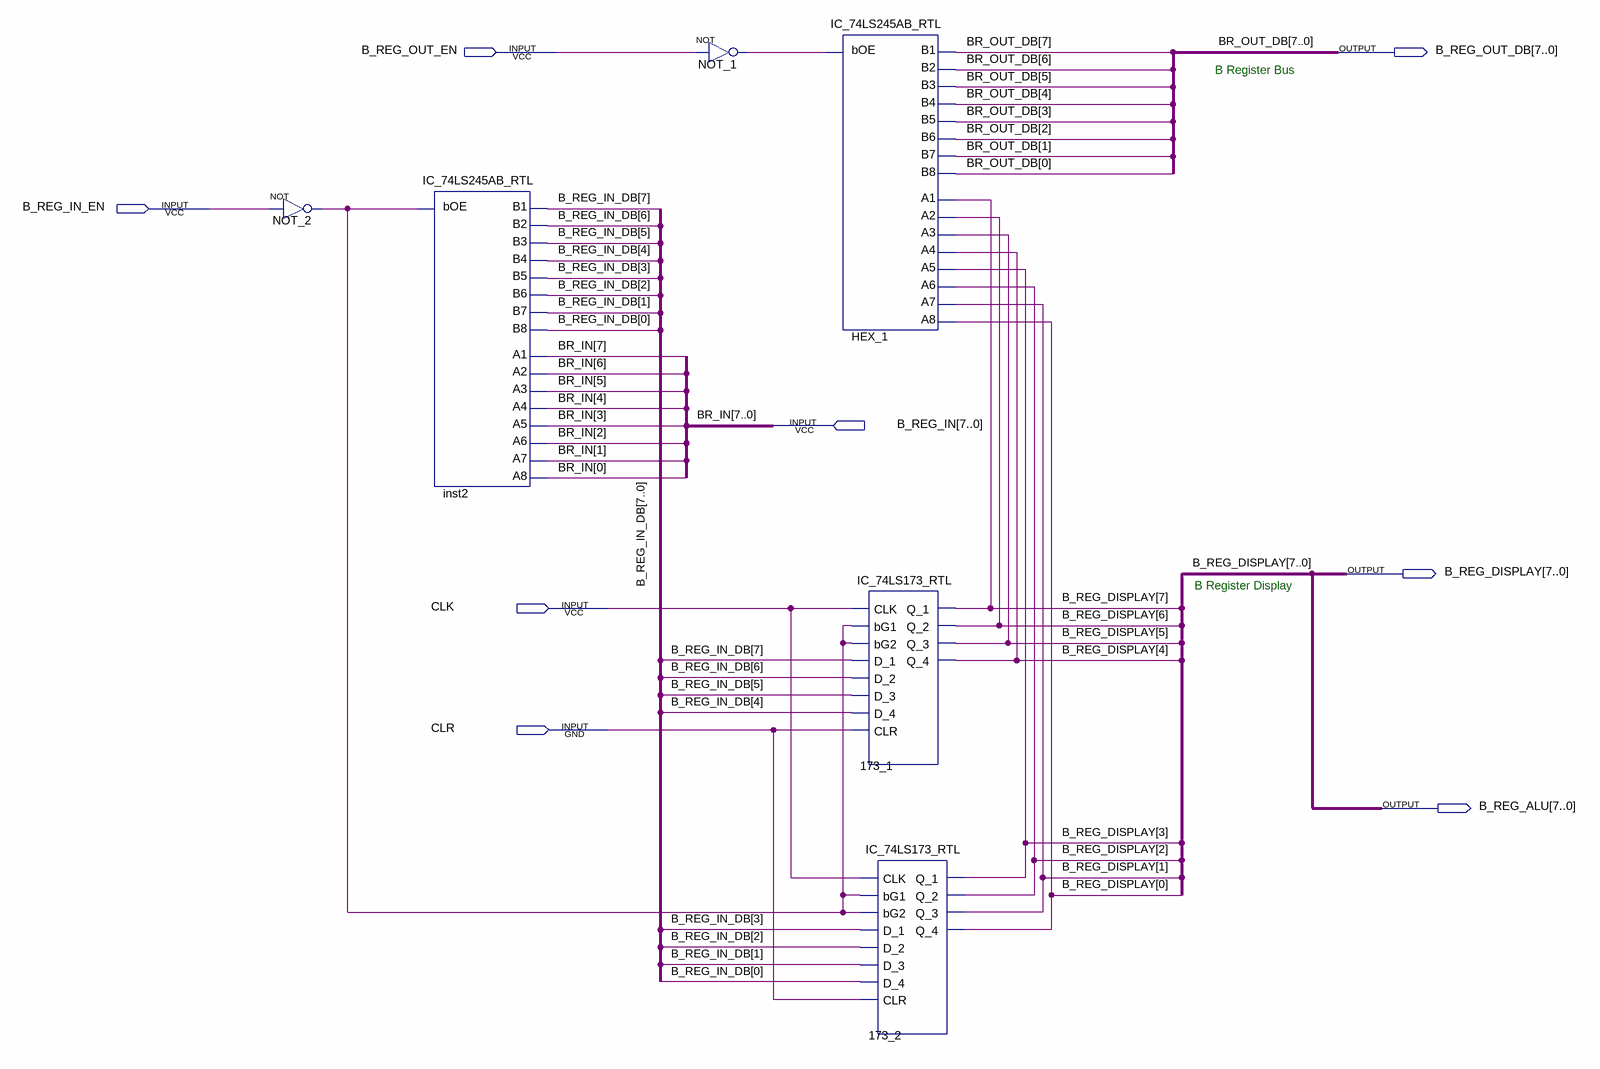
[diagram p0: schematic sheet]
// Quartus schematic B_Register.bdf as structural Verilog: 6 symbols, 8 pins
module B_Register (
  input  B_REG_OUT_EN,
  input  B_REG_IN_EN,
  input  [7:0] B_REG_IN,
  input  CLK,
  input  CLR,
  output [7:0] B_REG_OUT_DB,
  output [7:0] B_REG_DISPLAY,
  output [7:0] B_REG_ALU
);

  wire NOT_1_out, NOT_2_out;
  wire [7:0] B_REG_IN_DB;

  not NOT_2 (NOT_2_out, B_REG_IN_EN);
  IC_74LS245AB_RTL inst2 (
    .bOE(NOT_2_out), .A1(B_REG_IN[7]), .A2(B_REG_IN[6]), .A3(B_REG_IN[5]), .A4(B_REG_IN[4]),
    .A5(B_REG_IN[3]), .A6(B_REG_IN[2]), .A7(B_REG_IN[1]), .A8(B_REG_IN[0]), .B1(B_REG_IN_DB[7]),
    .B2(B_REG_IN_DB[6]), .B3(B_REG_IN_DB[5]), .B4(B_REG_IN_DB[4]), .B5(B_REG_IN_DB[3]), .B6(B_REG_IN_DB[2]),
    .B7(B_REG_IN_DB[1]), .B8(B_REG_IN_DB[0]));
  not NOT_1 (NOT_1_out, B_REG_OUT_EN);
  IC_74LS245AB_RTL HEX_1 (
    .bOE(NOT_1_out), .A1(B_REG_ALU[7]), .A2(B_REG_ALU[6]), .A3(B_REG_ALU[5]), .A4(B_REG_ALU[4]),
    .A5(B_REG_ALU[3]), .A6(B_REG_ALU[2]), .A7(B_REG_ALU[1]), .A8(B_REG_ALU[0]), .B1(B_REG_OUT_DB[7]),
    .B2(B_REG_OUT_DB[6]), .B3(B_REG_OUT_DB[5]), .B4(B_REG_OUT_DB[4]), .B5(B_REG_OUT_DB[3]),
    .B6(B_REG_OUT_DB[2]), .B7(B_REG_OUT_DB[1]), .B8(B_REG_OUT_DB[0]));
  IC_74LS173_RTL u_173_1 (
    .CLK(CLK), .bG1(NOT_2_out), .bG2(NOT_2_out), .D_1(B_REG_IN_DB[7]), .D_2(B_REG_IN_DB[6]),
    .D_3(B_REG_IN_DB[5]), .D_4(B_REG_IN_DB[4]), .CLR(CLR), .Q_1(B_REG_ALU[7]), .Q_2(B_REG_ALU[6]),
    .Q_3(B_REG_ALU[5]), .Q_4(B_REG_ALU[4]));
  IC_74LS173_RTL u_173_2 (
    .CLK(CLK), .bG1(NOT_2_out), .bG2(NOT_2_out), .D_1(B_REG_IN_DB[3]), .D_2(B_REG_IN_DB[2]),
    .D_3(B_REG_IN_DB[1]), .D_4(B_REG_IN_DB[0]), .CLR(CLR), .Q_1(B_REG_ALU[3]), .Q_2(B_REG_ALU[2]),
    .Q_3(B_REG_ALU[1]), .Q_4(B_REG_ALU[0]));

  assign B_REG_DISPLAY = B_REG_ALU;

  // Other names for the same wires on the sheet: BR_IN[7:0] = B_REG_IN; BR_OUT_DB[7:0] = B_REG_OUT_DB

  // Notes on the sheet:
  //   B Register Bus
  //   B Register Display
endmodule
